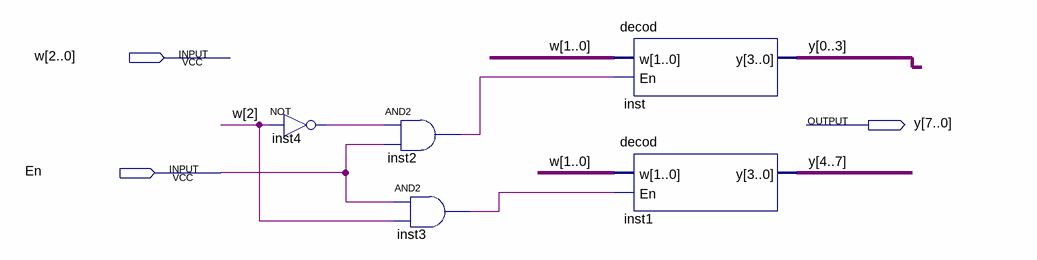
[diagram p0: schematic sheet]
// Quartus schematic decodModified.bdf as structural Verilog: 5 symbols, 3 pins
module decodModified (
  input  [2:0] w,
  input  En,
  output [7:0] y
);

  wire inst2_out, inst3_out, inst4_out;

  not inst4 (inst4_out, w[2]);
  and inst2 (inst2_out, inst4_out, En);
  and inst3 (inst3_out, En, w[2]);
  decod inst (.w(w[1:0]), .En(inst2_out), .y({y[0], y[1], y[2], y[3]}));
  decod inst1 (.w(w[1:0]), .En(inst3_out), .y({y[4], y[5], y[6], y[7]}));
endmodule
